# EAGLE design MotorController_ToniDove_Full04 (EAGLE 6.5.0)
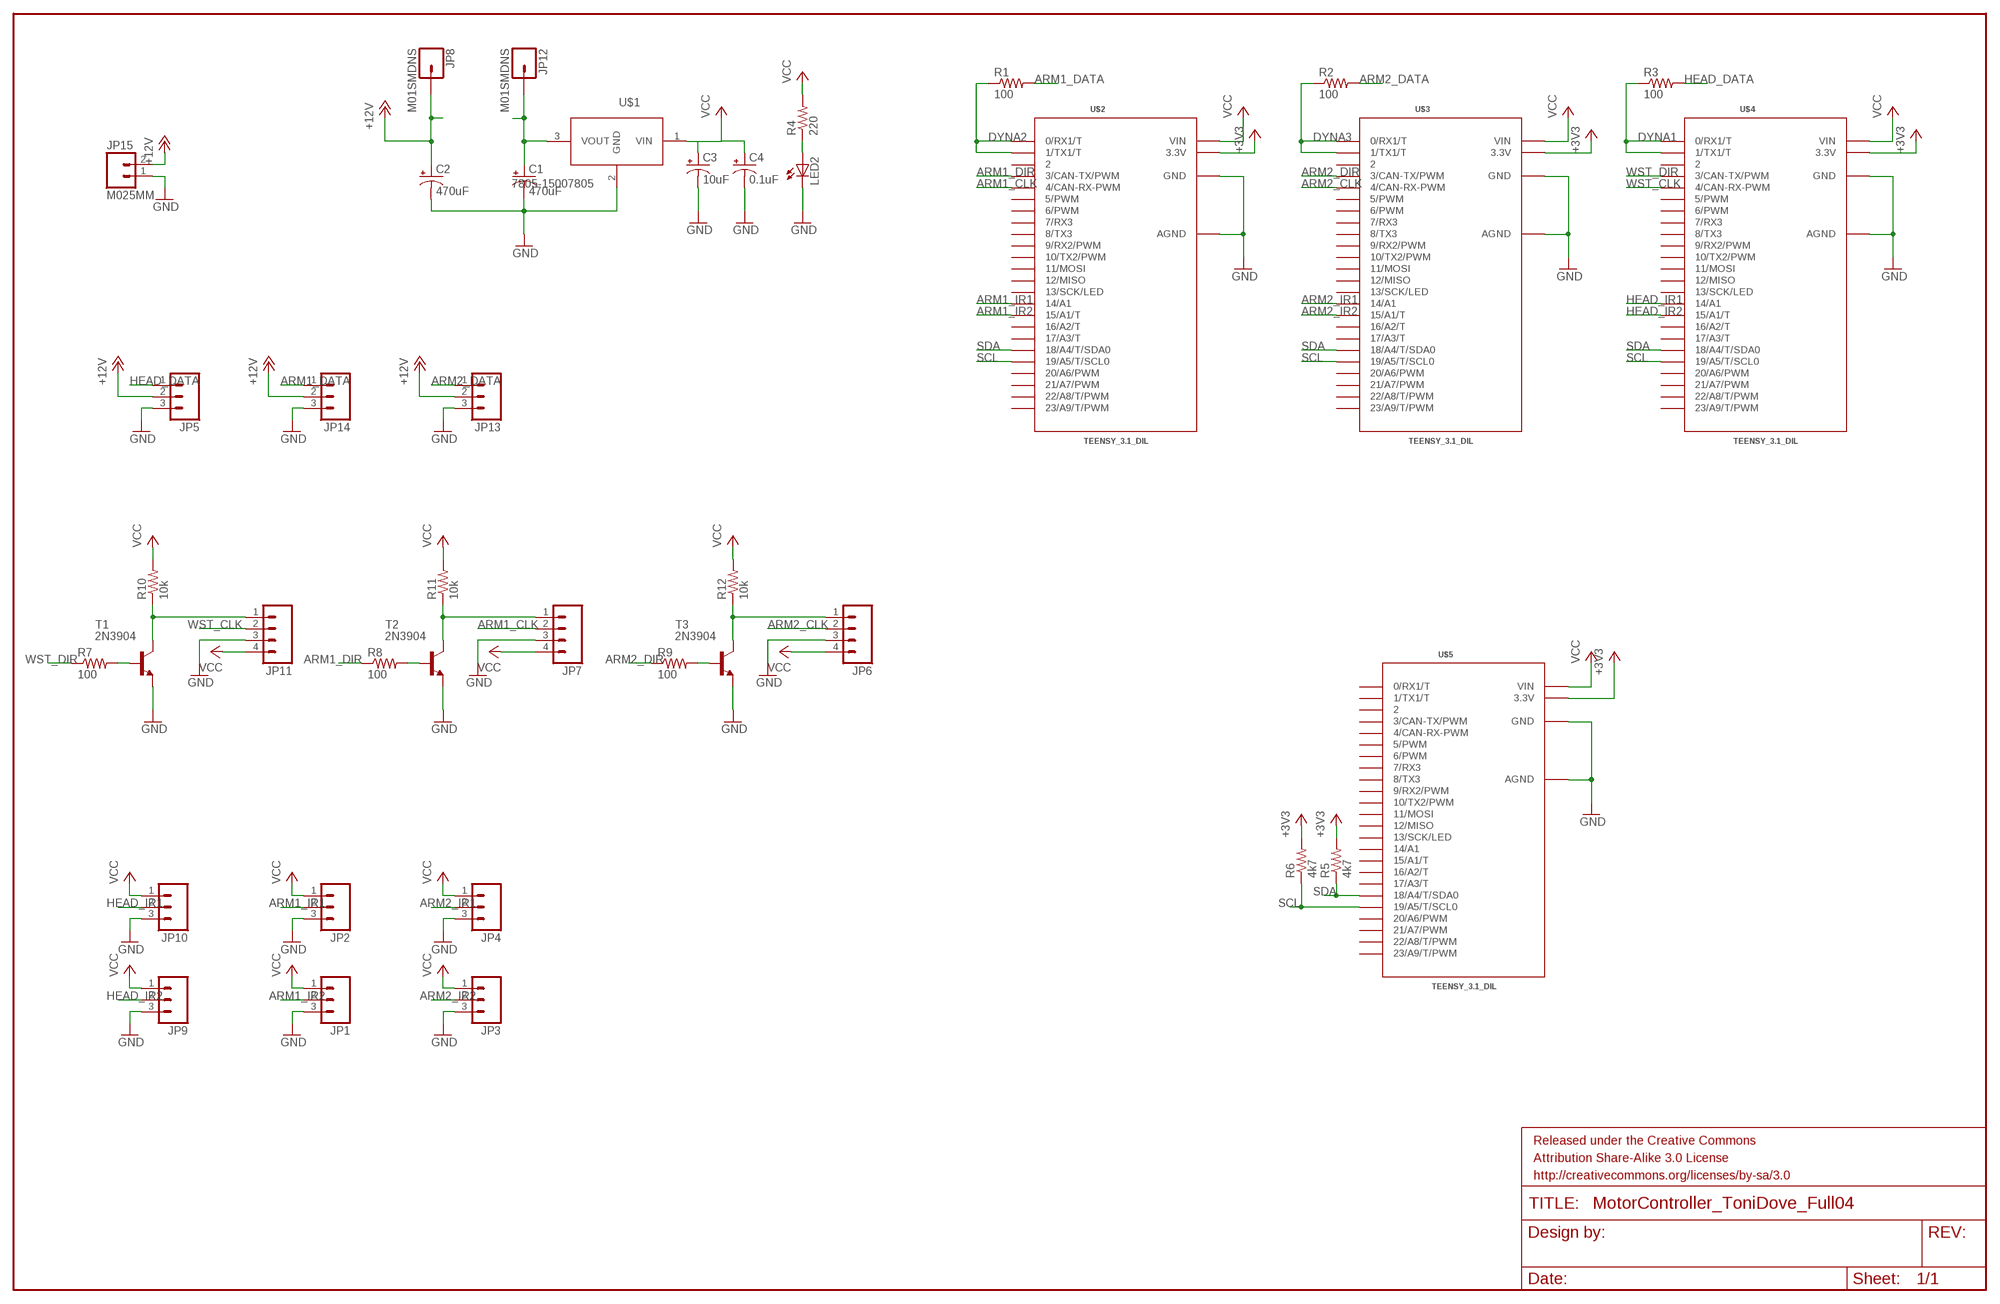
[diagram p0: schematic, sheet 1]

## Parts
C1  470uF  CPOL-USE5-13  [E5-13]
C2  470uF  CPOL-USE5-13  [E5-13]
C3  10uF  CPOL-USE2,5-6E  [E2,5-6E]
C4  0.1uF  CPOL-USE2,5-6E  [E2,5-6E]
FRAME1  FRAME-LEDGER  [CREATIVE_COMMONS]
JP1  M03PTH  [1X03]
JP2  M03PTH  [1X03]
JP3  M03PTH  [1X03]
JP4  M03PTH  [1X03]
JP5  M03PTH  [1X03]
JP6  M04SCREW  [SCREWTERMINAL-3.5MM-4]
JP7  M04SCREW  [SCREWTERMINAL-3.5MM-4]
JP8  M01SMDNS  [1X01NS]
JP9  M03PTH  [1X03]
JP10  M03PTH  [1X03]
JP11  M04SCREW  [SCREWTERMINAL-3.5MM-4]
JP12  M01SMDNS  [1X01NS]
JP13  M03PTH  [1X03]
JP14  M03PTH  [1X03]
JP15  M025MM  [SCREWTERMINAL-5MM-2]
LED2  LED5MM  [LED5MM]
R1  100  R-US_0204/7  [0204/7]
R2  100  R-US_0204/7  [0204/7]
R3  100  R-US_0204/7  [0204/7]
R4  220  R-US_0204/7  [0204/7]
R5  4k7  R-US_0204/7  [0204/7]
R6  4k7  R-US_0204/7  [0204/7]
R7  100  R-US_0204/7  [0204/7]
R8  100  R-US_0204/7  [0204/7]
R9  100  R-US_0204/7  [0204/7]
R10  10k  R-US_0204/7  [0204/7]
R11  10k  R-US_0204/7  [0204/7]
R12  10k  R-US_0204/7  [0204/7]
T1  2N3904  [TO92]
T2  2N3904  [TO92]
T3  2N3904  [TO92]
U$1  7805-15007805  [UL94-V0]
U$2  TEENSY_3.1_DIL  [TEENSY3-DIL]
U$3  TEENSY_3.1_DIL  [TEENSY3-DIL]
U$4  TEENSY_3.1_DIL  [TEENSY3-DIL]
U$5  TEENSY_3.1_DIL  [TEENSY3-DIL]

## Nets
+3V3: R5.2 R6.2 U$2.3.3V U$3.3.3V U$4.3.3V U$5.3.3V
+12V: C2.+ JP5.2 JP8.1 JP13.2 JP14.2 JP15.2
ARM1_CLK: JP7.2 U$2.4(4/CAN-RX-PWM)
ARM1_DATA: JP14.1 R1.2
ARM1_DIR: R8.1 U$2.3(3/CAN-TX/PWM)
ARM1_IR1: JP2.2 U$2.14/A0(14/A1)
ARM1_IR2: JP1.2 U$2.15/A1(15/A1/T)
ARM2_CLK: JP6.2 U$3.4(4/CAN-RX-PWM)
ARM2_DATA: JP13.1 R2.2
ARM2_DIR: R9.1 U$3.3(3/CAN-TX/PWM)
ARM2_IR1: JP4.2 U$3.14/A0(14/A1)
ARM2_IR2: JP3.2 U$3.15/A1(15/A1/T)
DYNA1: R3.1 U$4.0(0/RX1/T) U$4.1(1/TX1/T)
DYNA2: R1.1 U$2.0(0/RX1/T) U$2.1(1/TX1/T)
DYNA3: R2.1 U$3.0(0/RX1/T) U$3.1(1/TX1/T)
GND: C1.- C2.- C3.- C4.- JP1.3 JP2.3 JP3.3 JP4.3 JP5.3 JP6.3 JP7.3 JP9.3 JP10.3 JP11.3 JP13.3 JP14.3 JP15.1 LED2.K(C) T1.3(E) T2.3(E) T3.3(E) U$1.2(GND) U$2.AGND U$2.GND U$3.AGND U$3.GND U$4.AGND U$4.GND U$5.AGND U$5.GND
HEAD_DATA: JP5.1 R3.2
HEAD_IR1: JP10.2 U$4.14/A0(14/A1)
HEAD_IR2: JP9.2 U$4.15/A1(15/A1/T)
N$2: LED2.A R4.1
N$6: C1.+ JP12.1 U$1.3(VOUT)
N$7: R7.2 T1.2(B)
N$8: R8.2 T2.2(B)
N$9: R9.2 T3.2(B)
N$10: JP11.1 R10.1 T1.1(C)
N$11: JP7.1 R11.1 T2.1(C)
N$12: JP6.1 R12.1 T3.1(C)
SCL: R6.1 U$2.19/A5(19/A5/T/SCL0) U$3.19/A5(19/A5/T/SCL0) U$4.19/A5(19/A5/T/SCL0) U$5.19/A5(19/A5/T/SCL0)
SDA: R5.1 U$2.18/A4(18/A4/T/SDA0) U$3.18/A4(18/A4/T/SDA0) U$4.18/A4(18/A4/T/SDA0) U$5.18/A4(18/A4/T/SDA0)
VCC: C3.+ C4.+ JP1.1 JP2.1 JP3.1 JP4.1 JP6.4 JP7.4 JP9.1 JP10.1 JP11.4 R4.2 R10.2 R11.2 R12.2 U$1.1(VIN) U$2.VIN U$3.VIN U$4.VIN U$5.VIN
WST_CLK: JP11.2 U$4.4(4/CAN-RX-PWM)
WST_DIR: R7.1 U$4.3(3/CAN-TX/PWM)
Unconnected: U$2.2 U$2.5(5/PWM) U$2.6(6/PWM) U$2.7(7/RX3) U$2.8(8/TX3) U$2.9(9/RX2/PWM) U$2.10(10/TX2/PWM) U$2.11(11/MOSI) U$2.12(12/MISO) U$2.13(13/SCK/LED) U$2.16/A2(16/A2/T) U$2.17/A3(17/A3/T) U$2.20/A6(20/A6/PWM) U$2.21/A7(21/A7/PWM) U$2.22/A8(22/A8/T/PWM) U$2.23/A9(23/A9/T/PWM) U$3.2 U$3.5(5/PWM) U$3.6(6/PWM) U$3.7(7/RX3) U$3.8(8/TX3) U$3.9(9/RX2/PWM) U$3.10(10/TX2/PWM) U$3.11(11/MOSI) U$3.12(12/MISO) U$3.13(13/SCK/LED) U$3.16/A2(16/A2/T) U$3.17/A3(17/A3/T) U$3.20/A6(20/A6/PWM) U$3.21/A7(21/A7/PWM) U$3.22/A8(22/A8/T/PWM) U$3.23/A9(23/A9/T/PWM) U$4.2 U$4.5(5/PWM) U$4.6(6/PWM) U$4.7(7/RX3) U$4.8(8/TX3) U$4.9(9/RX2/PWM) U$4.10(10/TX2/PWM) U$4.11(11/MOSI) U$4.12(12/MISO) U$4.13(13/SCK/LED) U$4.16/A2(16/A2/T) U$4.17/A3(17/A3/T) U$4.20/A6(20/A6/PWM) U$4.21/A7(21/A7/PWM) U$4.22/A8(22/A8/T/PWM) U$4.23/A9(23/A9/T/PWM) U$5.0(0/RX1/T) U$5.1(1/TX1/T) U$5.2 U$5.3(3/CAN-TX/PWM) U$5.4(4/CAN-RX-PWM) U$5.5(5/PWM) U$5.6(6/PWM) U$5.7(7/RX3) U$5.8(8/TX3) U$5.9(9/RX2/PWM) U$5.10(10/TX2/PWM) U$5.11(11/MOSI) U$5.12(12/MISO) U$5.13(13/SCK/LED) U$5.14/A0(14/A1) U$5.15/A1(15/A1/T) U$5.16/A2(16/A2/T) U$5.17/A3(17/A3/T) U$5.20/A6(20/A6/PWM) U$5.21/A7(21/A7/PWM) U$5.22/A8(22/A8/T/PWM) U$5.23/A9(23/A9/T/PWM)

## Library data of the parts
C1-C4 = rcl:CPOL-US: POLARIZED CAPACITOR, American symbol
FRAME1 = SparkFun-Aesthetics:FRAME-LEDGER: Schematic Frame Standard 11x14 US Ledger frame
JP1-JP5 JP9 JP10 JP13 JP14 = SparkFun-Connectors:M03: Header 3 Standard 3-pin 0.1" header. Use with straight break away headers (SKU : PRT-00116), right angle break away headers (PRT-00553), swiss pins (PRT-00743), machine pins (PRT-00117), and female headers (PRT-00115). Molex polarized connector foot print use with SKU : PRT-08232 with associated crimp pins and housings.
JP6 JP7 JP11 = SparkFun-Connectors:M04: Header 4 Standard 4-pin 0.1" header. Use with straight break away headers (SKU : PRT-00116), right angle break away headers (PRT-00553), swiss pins (PRT-00743), machine pins (PRT-00117), and female headers (PRT-00115). Molex polarized connector foot print use with SKU : PRT-08231 with associated crimp pins and housings. 1MM SMD Version SKU: PRT-10208
JP8 JP12 = SparkFun-Connectors:M01: Header 1 Standard 1-pin 0.1" header. Use with straight break away headers (SKU : PRT-00116), right angle break away headers (PRT-00553), swiss pins (PRT-00743), machine pins (PRT-00117), and female headers (PRT-00115).
JP15 = SparkFun-Connectors:M02: Standard 2-pin 0.1" header. Use with - straight break away headers ( PRT-00116) - right angle break away headers (PRT-00553) - swiss pins (PRT-00743) - machine pins (PRT-00117) - female headers (PRT-00115) Molex polarized connector foot print use with: PRT-08233 with associated crimp pins and housings. 2.54_SCREWTERM for use with PRT-10571. 3.5mm Screw Terminal footprints for PRT-08084 5mm Screw Terminal footprints for use with PRT-08433
LED2 = SparkFun-LED:LED: LEDs Standard schematic elements and footprints for 5mm, 3mm, 1206, and 0603 sized LEDs. 5mm - Spark Fun Electronics SKU : COM-00529 (and others)
R1-R12 = rcl:R-US_: RESISTOR, American symbol
T1-T3 = transistor:2N3904: NPN TRANSISTOR
U$1 = EzerLonginus:7805-1500
U$2-U$5 = Teensy_3_and_LC_Series_Boards_v1.1:TEENSY_3.1_DIL: Teensy 3.1 or 3.2 in a DIL Layout.

## Board
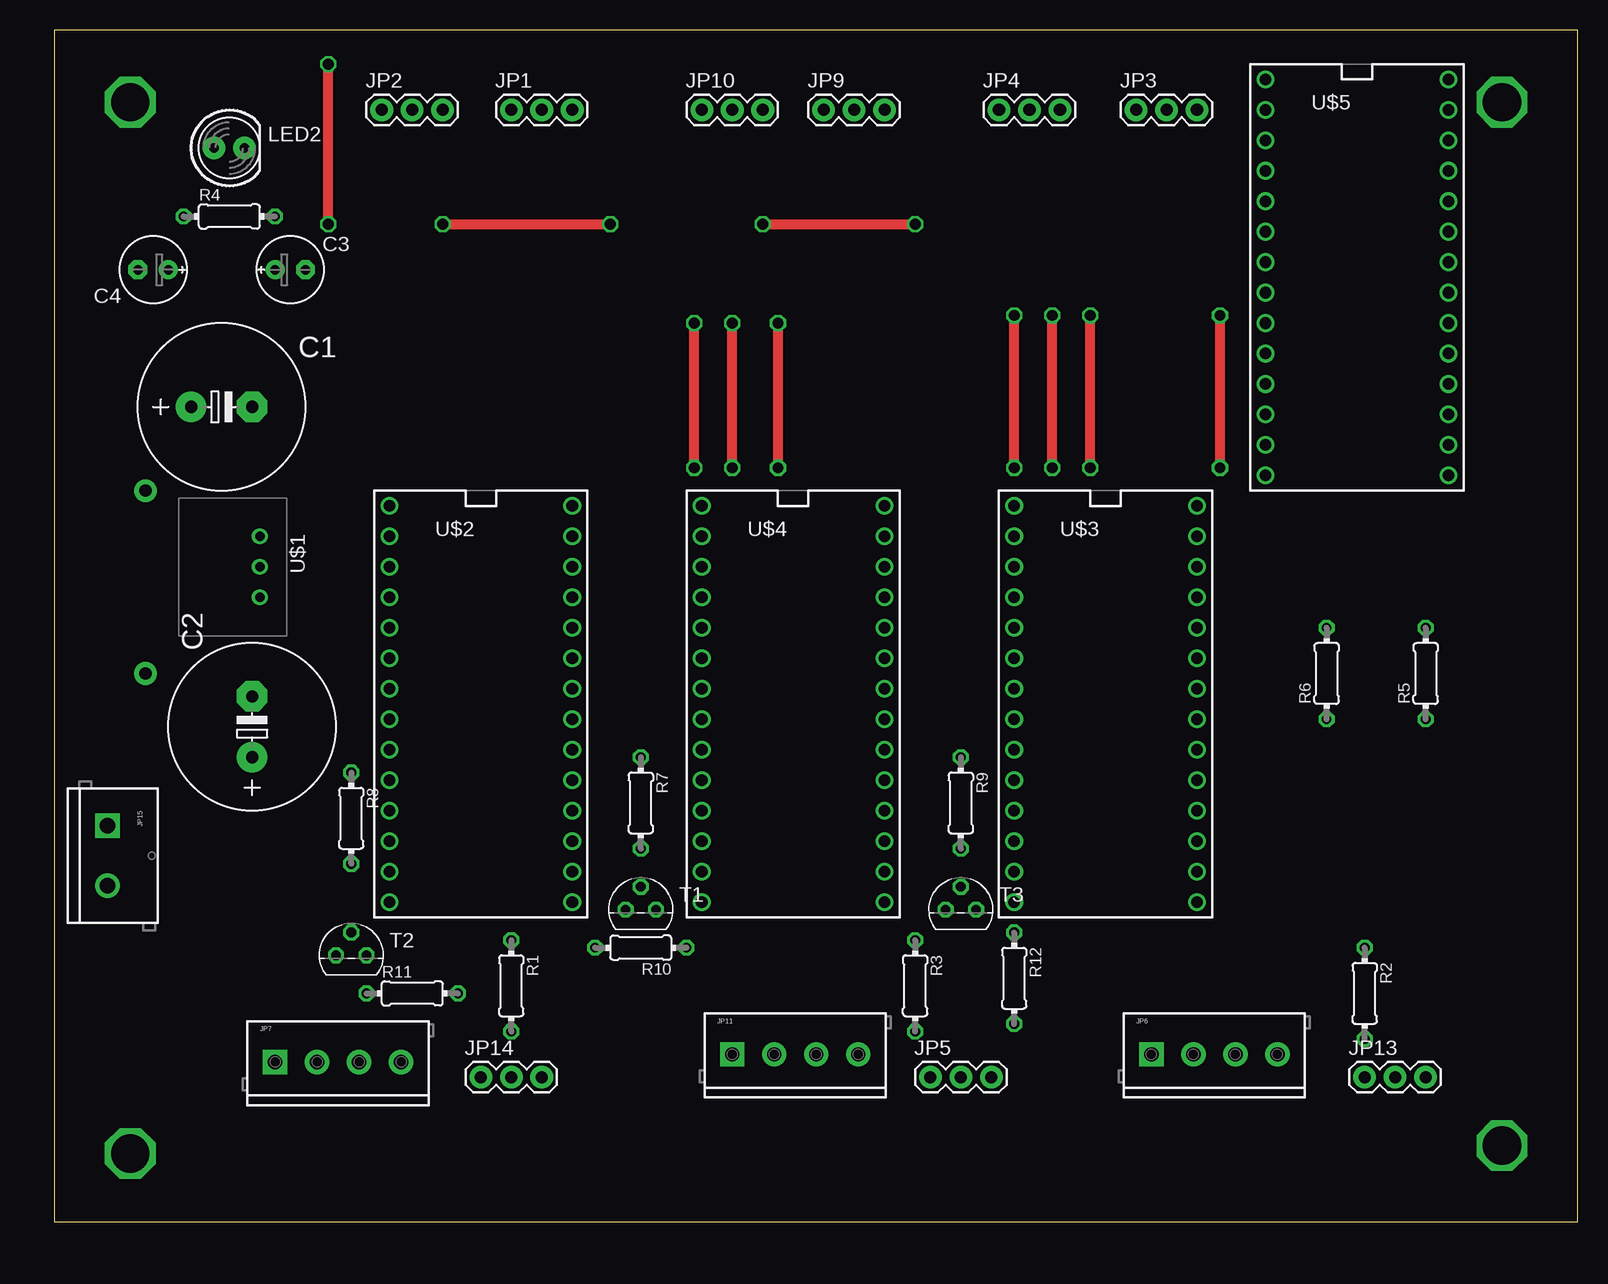
[diagram p1: board, top side]
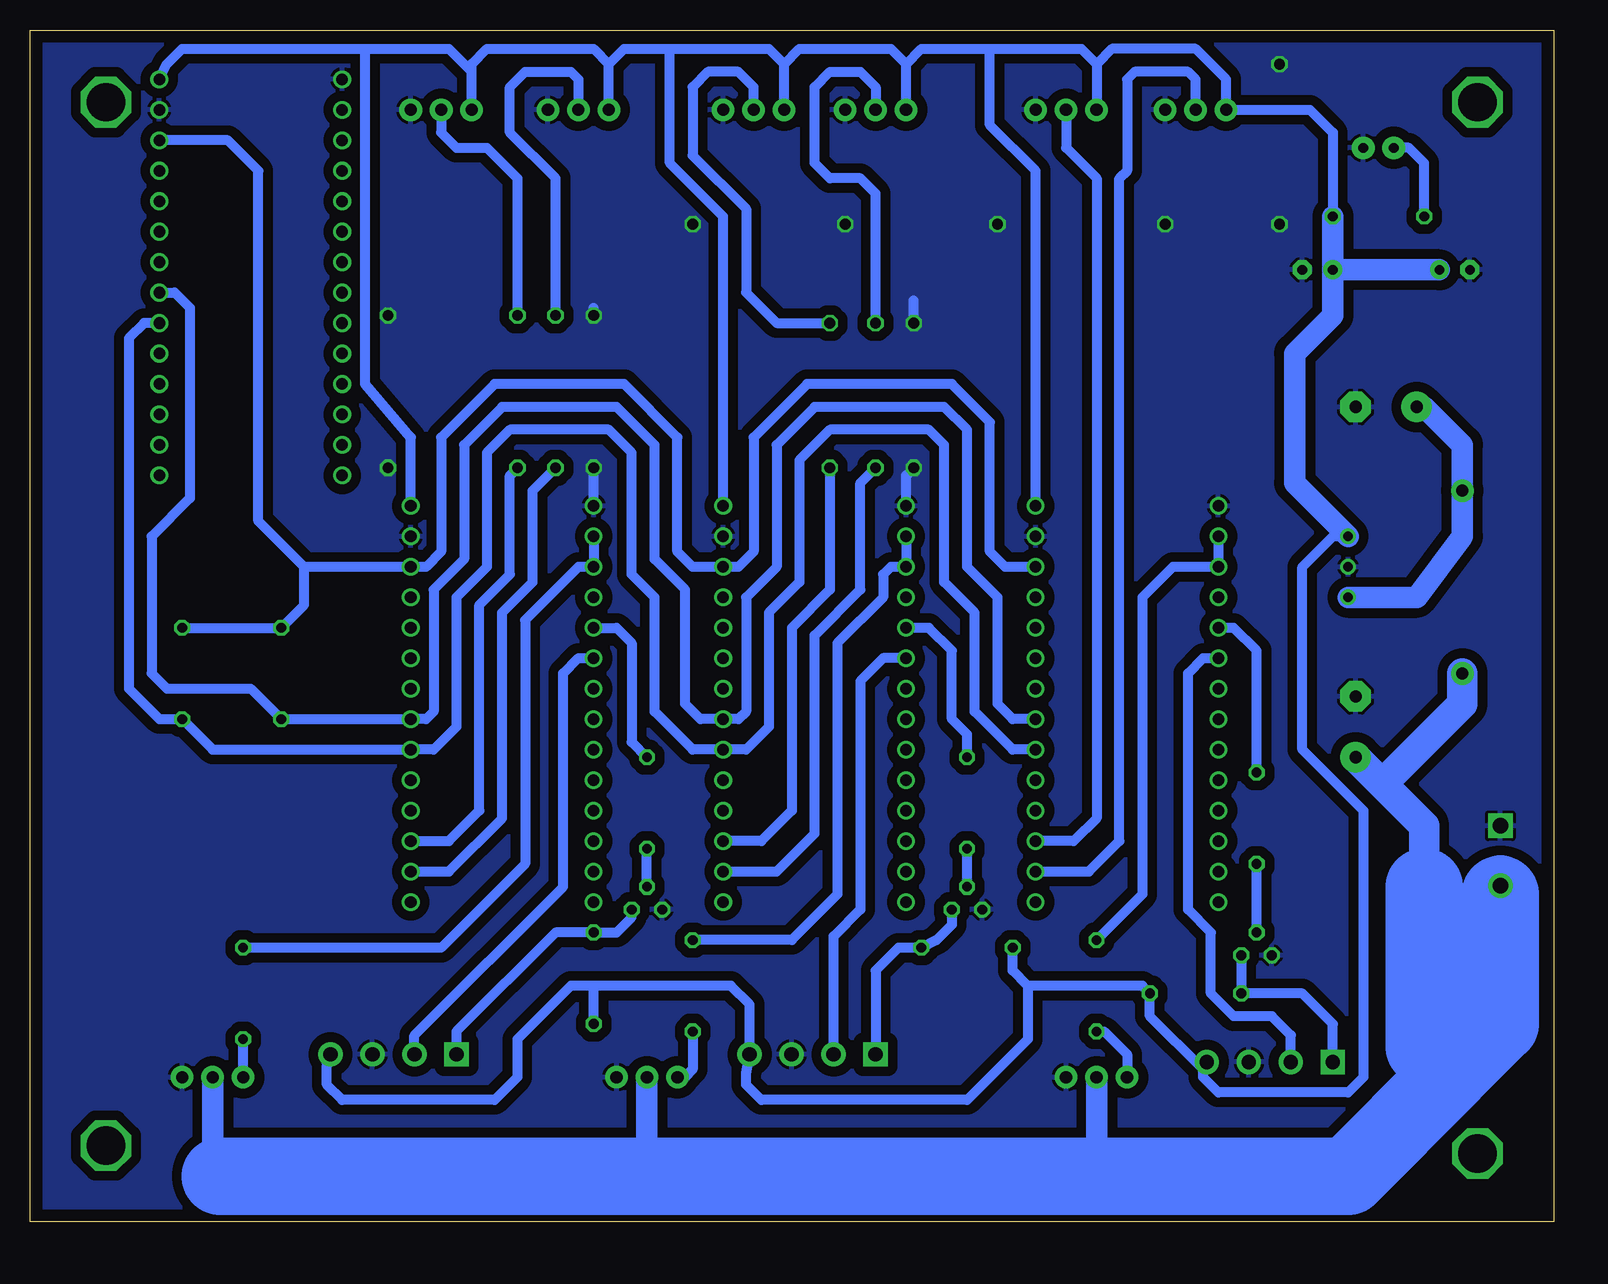
[diagram p2: board, bottom side, seen from below]

Size 126.98 x 99.36 mm. Coordinates in mm from the lower left corner, seen from the top.
Outline: 0,0 126.98,0 126.98,99.36 0,99.36 0,0
Copper layers (1*16): Top 0.035mm / dielectric 1.5mm / Bottom 0.035mm
Design rules "default": minimum track width 10mil, minimum drill 24mil, track to track 8mil, track to pad 8mil, pad to pad 8mil, via to via 8mil, smd to smd 8mil, copper to edge 40mil, drill to drill 8mil, minimum pad ring 10mil, minimum via ring 8mil, stop-mask expansion 4mil, vias tented up to drill 0mil, thermal gap 10mil

### Footprints (pad centres in the part's own frame; a part is rotated, then mirrored left to right if it is on the bottom)
E5-13 = drill 1.016 pad 2.54: + -2.54,0 | drill 1.016 pad 2.54 octagon: - 2.54,0
E2,5-6E = drill 0.813 pad 1.575: + -1.27,0 | drill 0.813 pad 1.575 octagon: - 1.27,0
1X03 = drill 1.016 pad 1.88: 1 0,0; 2 2.54,0; 3 5.08,0
SCREWTERMINAL-3.5MM-4 = drill 1.2 pad 2.032 square: 1 0,0 | drill 1.2 pad 2.032: 2 3.5,0; 3 7,0; 4 10.5,0
1X01NS = drill 1.016 pad 1.88: 1 0,0
SCREWTERMINAL-5MM-2 = drill 1.3 pad 2.032 square: 1 0,0 | drill 1.3 pad 2.032: 2 5,0
LED5MM = drill 0.813 pad 1.88: A -1.27,0; K 1.27,0
0204/7 = drill 0.813 octagon: 1 -3.81,0; 2 3.81,0
TO92 = drill 0.813 octagon: 1 1.27,0; 2 0,1.905; 3 -1.27,0
UL94-V0 = drill 0.8: 1 -2.54,0; 2 0,0; 3 2.54,0
TEENSY3-DIL = drill 0.965: 0 -7.62,13.97; 1 -7.62,11.43; 2 -7.62,8.89; 3 -7.62,6.35; 3.3V 7.62,11.43; 4 -7.62,3.81; 5 -7.62,1.27; 6 -7.62,-1.27; 7 -7.62,-3.81; 8 -7.62,-6.35; 9 -7.62,-8.89; 10 -7.62,-11.43; 11 -7.62,-13.97; 12 -7.62,-16.51; 13 7.62,-16.51; 14/A0 7.62,-13.97; 15/A1 7.62,-11.43; 16/A2 7.62,-8.89; 17/A3 7.62,-6.35; 18/A4 7.62,-3.81; 19/A5 7.62,-1.27; 20/A6 7.62,1.27; 21/A7 7.62,3.81; 22/A8 7.62,6.35; 23/A9 7.62,8.89; AGND 7.62,13.97; GND -7.62,16.51; VIN 7.62,16.51

### Placement (x,y rotation side)
C1  13.97,67.94 0 top
C2  16.51,41.27 90 top
C3  19.68,79.38 0 top
C4  8.26,79.38 180 top
FRAME1  1.91,-15.88 0 top  (outside the outline)
JP1  38.1,92.71 0 top
JP2  27.3,92.71 0 top
JP3  90.17,92.71 0 top
JP4  78.74,92.71 0 top
JP5  73.03,12.06 0 top
JP6  91.44,13.97 0 top
JP7  18.41,13.34 0 top
JP8  7.62,45.72 0 top
JP9  64.14,92.71 0 top
JP10  53.98,92.71 0 top
JP11  56.52,13.97 0 top
JP12  7.62,60.96 0 top
JP13  109.22,12.06 0 top
JP14  35.56,12.06 0 top
JP15  4.45,33.02 270 top
LED2  14.61,89.53 0 top
R1  38.1,19.68 270 top
R2  109.22,19.05 270 top
R3  71.75,19.68 270 top
R4  14.61,83.82 0 top
R5  114.3,45.72 90 top
R6  106.05,45.72 90 top
R7  48.9,34.92 270 top
R8  24.77,33.66 270 top
R9  75.56,34.92 270 top
R10  48.9,22.86 180 top
R11  29.84,19.05 0 top
R12  80.01,20.32 270 top
T1  48.9,26.04 0 top
T2  24.77,22.23 0 top
T3  75.56,26.04 0 top
U$1  17.14,54.61 270 top
U$2  35.56,43.18 0 top
U$3  87.63,43.18 0 top
U$4  61.59,43.18 0 top
U$5  108.58,78.74 0 top

### Tracks (layer width: path | path; a pad name or v marks a point on that pad's centre or on a via)
+3V3
  Bottom 0.813: U$2.3.3V 45.72,54.61 46.99,55.88 46.99,66.67 50.16,69.85 62.23,69.85 66.67,65.41 66.67,55.88 67.94,54.61 U$4.3.3V 71.75,54.61 73.03,55.88 73.03,65.41 77.47,69.85 88.27,69.85 92.71,65.41 92.71,55.88 93.98,54.61 U$3.3.3V 104.14,54.61 | 104.14,54.61 107.95,58.42 107.95,87.63 110.49,90.17 U$5.3.3V | R5.2 R6.2 104.14,51.44 104.14,54.61
+12V
  Bottom 1.778: 76.2,2.54 75.56,3.81 JP5.2 | JP13.2 111.76,2.54 111.12,2.54 | JP14.2 38.1,3.81 37.47,3.81 | 26.68,2.56 24.78,2.56 24.77,2.54 25.4,2.54 | 62.88,3.19 63.5,3.81 | 98.44,3.19 98.42,3.81
  Bottom 2.54: 25.41,3.81 26.68,2.56 25.4,2.54 | 98.44,3.19 98.44,2.56 98.42,2.54 | 111.12,3.81 111.12,3.17 110.49,3.81 111.12,3.81 | 111.12,3.81 113.03,3.81 111.76,2.54 | 10.79,27.94 10.79,33.02 14.29,36.51 | 14.29,36.51 C2.+ | JP8.1 7.62,43.18 14.29,36.51
  Bottom 5.08: 4.45,26.75 4.45,27.3 JP15.2 4.53,27.94
  Bottom 6.452: 111.12,3.81 98.42,3.81 75.56,3.81 63.5,3.81 37.47,3.81 25.41,3.81 17.14,3.81 8.57,12.38 | 8.57,12.38 4.45,16.51 4.45,27.3 | 10.79,27.94 10.79,14.61 8.57,12.38
ARM1_CLK
  Bottom 0.813: JP7.2 21.91,15.56 23.5,17.14 26.67,17.14 28.57,19.05 28.57,24.13 30.48,26.04 30.48,45.72 29.21,46.99 U$2.4
ARM1_DATA
  Bottom 0.813: R1.2 37.47,15.88 35.56,13.97 JP14.1
ARM1_DIR
  Bottom 0.813: R8.1 24.77,47.62 26.67,49.53 U$2.3
ARM1_IR1
  Bottom 0.813: U$2.14/A0 38.73,29.21 36.2,31.75 36.2,87 35.56,87.63 35.56,95.25 34.92,95.89 30.48,95.89 29.84,95.25 JP2.2
ARM1_IR2
  Bottom 0.813: JP1.2 40.64,89.53 38.1,87 38.1,33.66 40.01,31.75 U$2.15/A1
ARM2_CLK
  Bottom 0.813: JP6.2 94.94,15.55 82.55,27.94 82.55,45.72 81.28,46.99 U$3.4
ARM2_DATA
  Bottom 0.813: JP13.1 R2.2
ARM2_DIR
  Bottom 0.813: U$3.3 78.11,49.53 76.83,48.26 76.83,40.01 R9.1
ARM2_IR1  (via drill 0.9)
  Top 0.813: v83.19,62.87 v83.19,75.56
  Bottom 0.813: U$3.14/A0 92.08,29.21 87.63,33.66 87.63,50.8 85.09,53.34 85.09,60.96 v83.19,62.87 | v83.19,75.56 83.19,87 87,90.81 87,94.61 85.72,95.89 81.92,95.89 81.28,95.25 JP4.2
ARM2_IR2  (via drill 0.9)
  Top 0.813: v86.36,62.87 v86.36,75.56
  Bottom 0.813: U$3.15/A1 92.08,31.75 89.53,34.29 89.53,51.44 87,53.98 87,62.23 v86.36,62.87 | JP3.2 92.71,90.81 91.44,89.53 88.9,89.53 86.36,87 v86.36,75.56
DYNA1
  Bottom 0.813: U$4.0 U$4.1 55.24,54.61 55.88,53.98 55.88,52.07 59.69,48.26 59.69,27.3 63.5,23.5 R3.1
DYNA2
  Bottom 0.813: U$2.0 U$2.1 31.75,54.61 34.29,52.07 34.29,27.3 R1.1
DYNA3
  Bottom 0.813: U$3.0 U$3.1 81.28,54.61 85.72,50.16 85.72,29.84 92.71,22.86 R2.1
GND  (via drill 0.9)
  Top 0.813: v32.38,83.19 v46.35,83.19 | v97.16,75.56 v97.16,62.87 | v59.05,83.19 v71.75,83.19 | v53.34,62.87 v53.34,74.93 | v80.01,62.87 v80.01,75.56 | v22.86,83.19 v22.86,96.52
  Bottom 0.813: U$4.GND 53.98,62.23 v53.34,62.87 | v53.34,74.93 53.34,76.83 | U$3.GND v80.01,62.87 | v80.01,75.56 80.01,76.2
  pour Bottom (isolate 0.813): -0.64,99.06 127.64,99.06 127,-0.64 -0.64,0
HEAD_DATA
  Bottom 0.813: R3.2 71.75,12.7 72.39,12.06 JP5.1
HEAD_IR1  (via drill 0.9)
  Top 0.813: v56.52,62.87 v56.52,74.93
  Bottom 0.813: U$4.14/A0 64.77,29.21 61.59,32.38 61.59,48.9 57.78,52.7 57.78,61.59 v56.52,62.87 | v56.52,74.93 56.52,85.72 57.78,87 60.33,87 61.59,88.27 61.59,94.61 60.33,95.89 57.78,95.89 56.52,94.61 JP10.2
HEAD_IR2  (via drill 0.9)
  Top 0.813: v60.33,74.93 v60.33,62.87
  Bottom 0.813: JP9.2 66.67,94.61 67.94,95.89 70.48,95.89 71.75,94.61 71.75,88.9 67.31,84.45 67.31,77.47 64.77,74.93 v60.33,74.93 | v60.33,62.87 60.33,52.7 63.5,49.53 63.5,34.29 66.04,31.75 U$4.15/A1
N$1  (via drill 3.2)
  other vias: 6.35,93.34
N$2
  Bottom 0.813: R4.1 10.79,88.27 12.06,89.53 LED2.A
N$3  (via drill 3.2)
  other vias: 6.35,5.71
N$4  (via drill 3.2)
  other vias: 120.65,93.34
N$5  (via drill 3.2)
  other vias: 120.65,6.35
N$6
  Bottom 1.778: C1.+ 10.79,67.94 7.62,64.77 JP12.1 7.62,57.15 11.43,52.07 U$1.3
N$7
  Bottom 0.813: T1.2 R7.2
N$8
  Bottom 0.813: T2.2 R8.2
N$9
  Bottom 0.813: T3.2 R9.2
N$10
  Bottom 0.813: T1.1 50.16,24.77 51.44,23.5 R10.1 54.61,22.86 56.52,20.95 JP11.1
N$11
  Bottom 0.813: T2.1 R11.1 20.95,19.05 18.41,16.51 JP7.1
N$12
  Bottom 0.813: T3.1 76.83,25.4 78.11,24.13 R12.1 83.19,24.13 91.44,15.88 JP6.1
SCL
  Bottom 0.813: U$2.19/A5 45.09,41.91 46.35,43.18 46.35,52.07 48.9,54.61 48.9,66.04 50.8,67.94 61.59,67.94 64.77,64.77 64.77,54.61 67.31,52.07 67.31,42.55 67.94,41.91 U$4.19/A5 71.12,41.91 72.39,43.18 72.39,52.7 74.93,55.24 74.93,64.77 78.11,67.94 87.63,67.94 90.81,64.77 90.81,55.24 93.34,52.7 93.34,42.55 93.98,41.91 U$3.19/A5 R6.1 108.58,44.45 115.57,44.45 116.84,45.72 116.84,57.15 113.67,60.33 113.67,76.2 114.94,77.47 U$5.19/A5
SDA
  Bottom 0.813: U$2.18/A4 45.09,39.37 48.26,42.55 48.26,50.8 50.8,53.34 50.8,64.77 52.07,66.04 60.33,66.04 62.87,63.5 62.87,53.34 65.41,50.8 65.41,41.27 67.31,39.37 U$4.18/A4 71.75,39.37 74.93,42.55 74.93,52.07 76.83,53.98 76.83,64.14 78.74,66.04 87,66.04 88.9,64.14 88.9,54.61 91.44,52.07 91.44,41.27 93.34,39.37 U$3.18/A4 111.76,39.37 R5.1 116.2,41.91 118.75,44.45 118.75,73.66 117.47,74.93 U$5.18/A4
VCC
  Bottom 0.813: R4.2 18.41,90.81 20.32,92.71 JP2.1 27.3,95.25 29.84,97.79 36.83,97.79 38.1,96.52 | 38.1,96.52 JP1.1 | JP10.1 53.98,96.52 | 53.98,96.52 52.7,97.79 46.99,97.79 | 46.99,97.79 39.37,97.79 38.1,96.52 | U$2.VIN 43.18,87.63 46.99,91.44 46.99,97.79 | JP9.1 64.14,96.52 | 64.14,96.52 62.87,97.79 55.24,97.79 53.98,96.52 | JP4.1 78.74,96.52 | 78.74,96.52 77.47,97.79 73.66,97.79 | 73.66,97.79 65.41,97.79 64.14,96.52 | JP3.1 90.17,95.89 | 90.17,95.89 90.17,96.52 88.9,97.79 80.01,97.79 78.74,96.52 | U$5.VIN 115.57,96.52 114.3,97.79 99.06,97.79 | 99.06,97.79 92.08,97.79 90.17,95.89 | U$4.VIN 69.22,83.82 73.66,88.27 73.66,97.79 | U$3.VIN 95.25,65.41 99.06,69.85 99.06,97.79 | 80.01,19.68 68.58,19.68 67.02,18.12 JP11.4 67.31,12.4 67.31,11.43 66.04,10.16 48.9,10.16 43.81,15.24 43.81,19.68 | 80.01,19.68 81.92,19.68 86.36,15.24 86.36,12.06 88.27,10.16 100.97,10.16 102.23,11.43 102.23,13.04 JP6.4 | U$1.1 18.41,57.15 20.95,54.61 20.95,39.37 15.88,34.29 15.88,12.06 17.14,10.79 27.94,10.79 29.21,12.06 29.21,12.4 JP7.4 29.21,12.7 33.66,17.14 R11.2 34.29,19.68 43.81,19.68 | 43.81,19.68 45.09,20.95 R10.2 | R12.2 80.01,19.68
  Bottom 1.778: C3.+ 18.41,75.56 21.59,72.39 21.59,61.59 U$1.1 | C4.+ C3.+ | R4.2 C3.+
WST_CLK
  Bottom 0.813: U$4.4 55.88,46.99 57.78,45.09 57.78,26.04 60.02,23.8 JP11.2
WST_DIR
  Bottom 0.813: R7.1 48.9,40.64 50.16,41.91 50.16,47.62 52.07,49.53 U$4.3